# EAGLE design 297-298 (EAGLE 5.01)
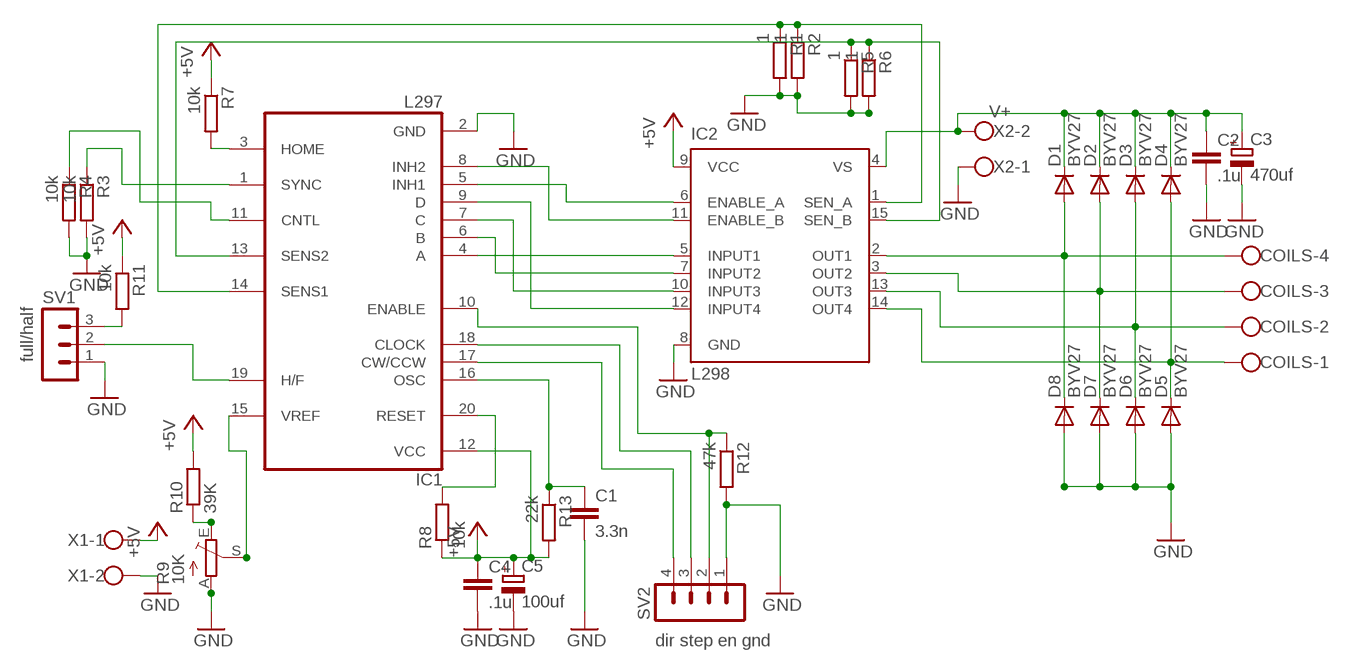
[diagram p0: schematic, sheet 1]

## Parts
C1  3.3n  C2.5/5  [C2.5-5]
C2  .1u  C2.5/5  [C2.5-5]
C3  470uf  CPOL-EUE3.5-8  [E3,5-8]
C4  .1u  C2.5/5  [C2.5-5]
C5  100uf  CPOL-EUE3.5-8  [E3,5-8]
COILS  W237-4  [W237-4]
D1  BYV27  [SOD57-10]
D2  BYV27  [SOD57-10]
D3  BYV27  [SOD57-10]
D4  BYV27  [SOD57-10]
D5  BYV27  [SOD57-10]
D6  BYV27  [SOD57-10]
D7  BYV27  [SOD57-10]
D8  BYV27  [SOD57-10]
IC1  L297  [DIL20]
IC2  L298  [MULTIWATT-15]
R1  1  R-EU_0207/15  [0207/15]
R2  1  R-EU_0207/15  [0207/15]
R3  10k  R-EU_0207/10  [0207/10]
R4  10k  R-EU_0207/10  [0207/10]
R5  1  R-EU_0207/15  [0207/15]
R6  1  R-EU_0207/15  [0207/15]
R7  10k  R-EU_0207/10  [0207/10]
R8  10k  R-EU_0207/10  [0207/10]
R9  10K  TRIM_EU-CA9V  [CA9V]
R10  39K  R-EU_0207/10  [0207/10]
R11  10k  R-EU_0207/10  [0207/10]
R12  47k  R-EU_0207/10  [0207/10]
R13  22k  R-EU_0207/10  [0207/10]
SV1  MA03-1  [MA03-1]
SV2  MA04-1  [MA04-1]
X1  W237-102  [W237-102]
X2  V+  W237-102  [W237-102]

## Nets
+5V: C4.1 C5.+ IC1.12(VCC) IC2.9(VCC) R7.1 R8.1 R10.2 R11.1 R13.2 X1.1
GND: C1.2 C2.2 C3.- C4.2 C5.- D5.A D6.A D7.A D8.A IC1.2(GND) IC2.8(GND) R1.2 R2.2 R3.2 R4.2 R5.2 R6.2 R9.A R12.2 SV1.1 SV2.1 X1.2 X2.1
N$1: IC1.4(A) IC2.5(INPUT1)
N$2: IC1.6(B) IC2.7(INPUT2)
N$3: IC1.7(C) IC2.10(INPUT3)
N$4: IC1.9(D) IC2.12(INPUT4)
N$5: IC1.8(INH2) IC2.11(ENABLE_B)
N$6: IC1.5(INH1) IC2.6(ENABLE_A)
N$7: IC1.15(VREF) R9.S
N$8: R9.E R10.1
N$9: COILS.4 D1.A D8.C IC2.2(OUT1)
N$10: COILS.3 D2.A D7.C IC2.3(OUT2)
N$11: COILS.2 D3.A D6.C IC2.13(OUT3)
N$12: COILS.1 D4.A D5.C IC2.14(OUT4)
N$13: IC1.13(SENS2) IC2.15(SEN_B) R5.1 R6.1
N$14: IC1.14(SENS1) IC2.1(SEN_A) R1.1 R2.1
N$15: IC1.1(SYNC) R3.1
N$16: IC1.19(H/F) SV1.2
N$17: R11.2 SV1.3
N$18: IC1.10(ENABLE) R12.1 SV2.2
N$19: IC1.18(CLOCK) SV2.3
N$20: IC1.17(CW/CCW) SV2.4
N$21: C1.1 IC1.16(OSC) R13.1
N$22: IC1.11(CNTL) R4.1
N$23: IC1.3(HOME) R7.2
N$24: C2.1 C3.+ D1.C D2.C D3.C D4.C IC2.4(VS) X2.2
N$25: IC1.20(RESET) R8.2

## Notes on the sheet
- full/half
- dir step en gnd

## Library data of the parts
C1 C2 C4 = capacitor-wima:C: CAPACITOR naming: grid - package width
C3 C5 = rcl:CPOL-EU: POLARIZED CAPACITOR, European symbol
COILS = con-wago-500:W237-4: WAGO SCREW CLAMP
D1-D8 = diode:BYV27: DIODE ultra fast
IC1 = st-microelectronics:L297: STEPPER MOTOR CONTROLLER
IC2 = st-microelectronics:L298: DUAL FULL-BRIDGE DRIVER
R1 R2 R5 R6 = resistor:R-EU_: RESISTOR, European symbol
R3 R4 R7 R8 R10-R13 = rcl:R-EU_: RESISTOR, European symbol
R9 = pot:TRIM_EU-: POTENTIOMETER
SV1 = con-lstb:MA03-1: PIN HEADER
SV2 = con-lstb:MA04-1: PIN HEADER
X1 X2 = con-wago-500:W237-102: WAGO SCREW CLAMP

## Board
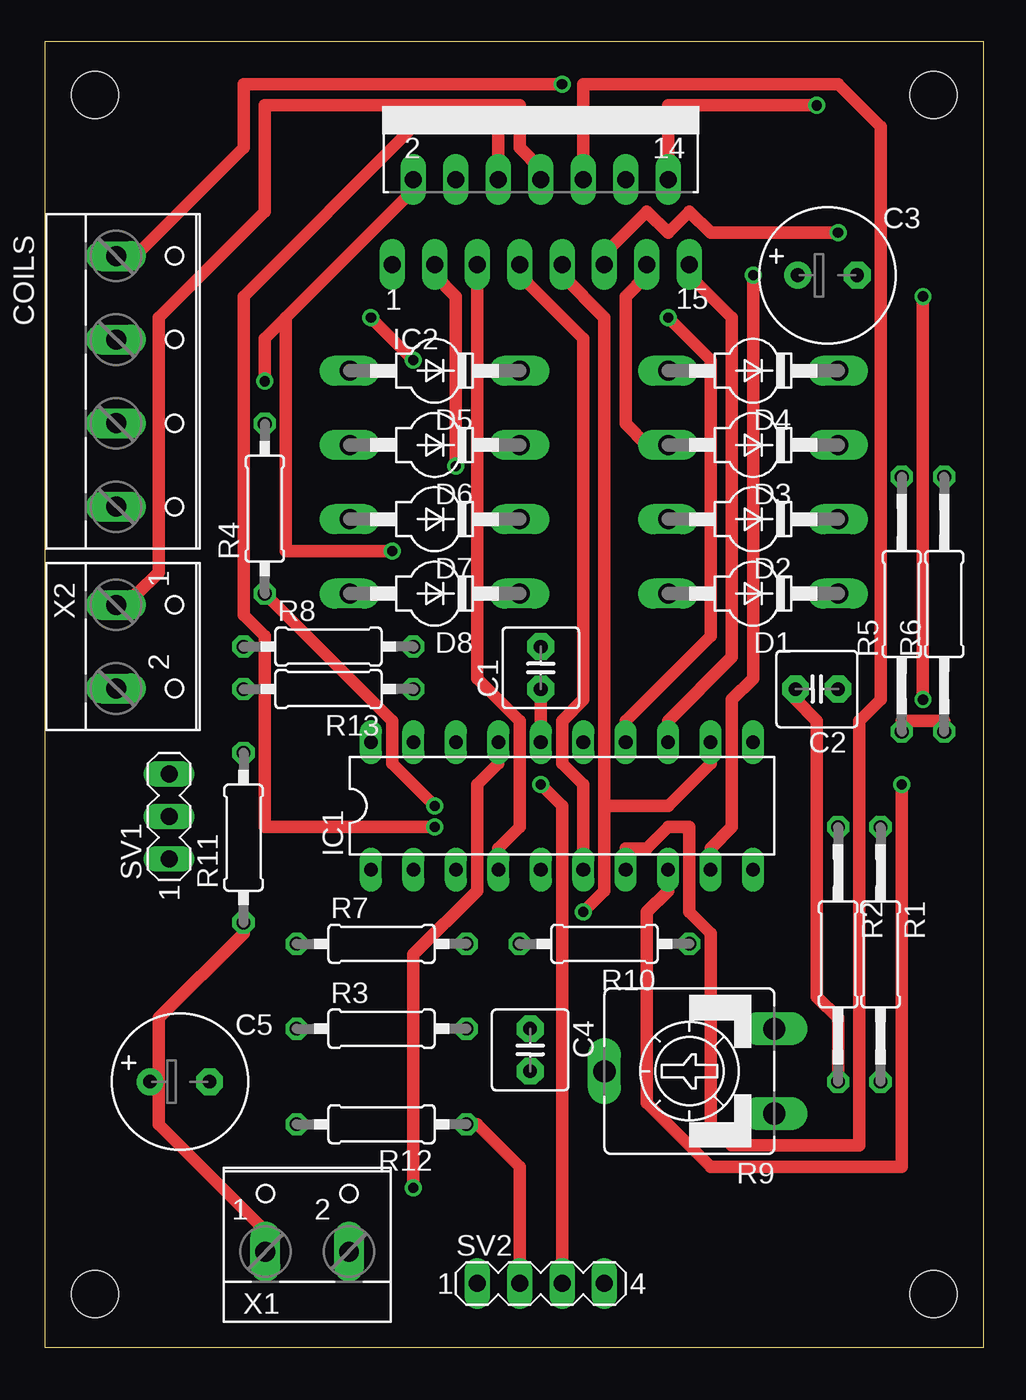
[diagram p1: board, top side]
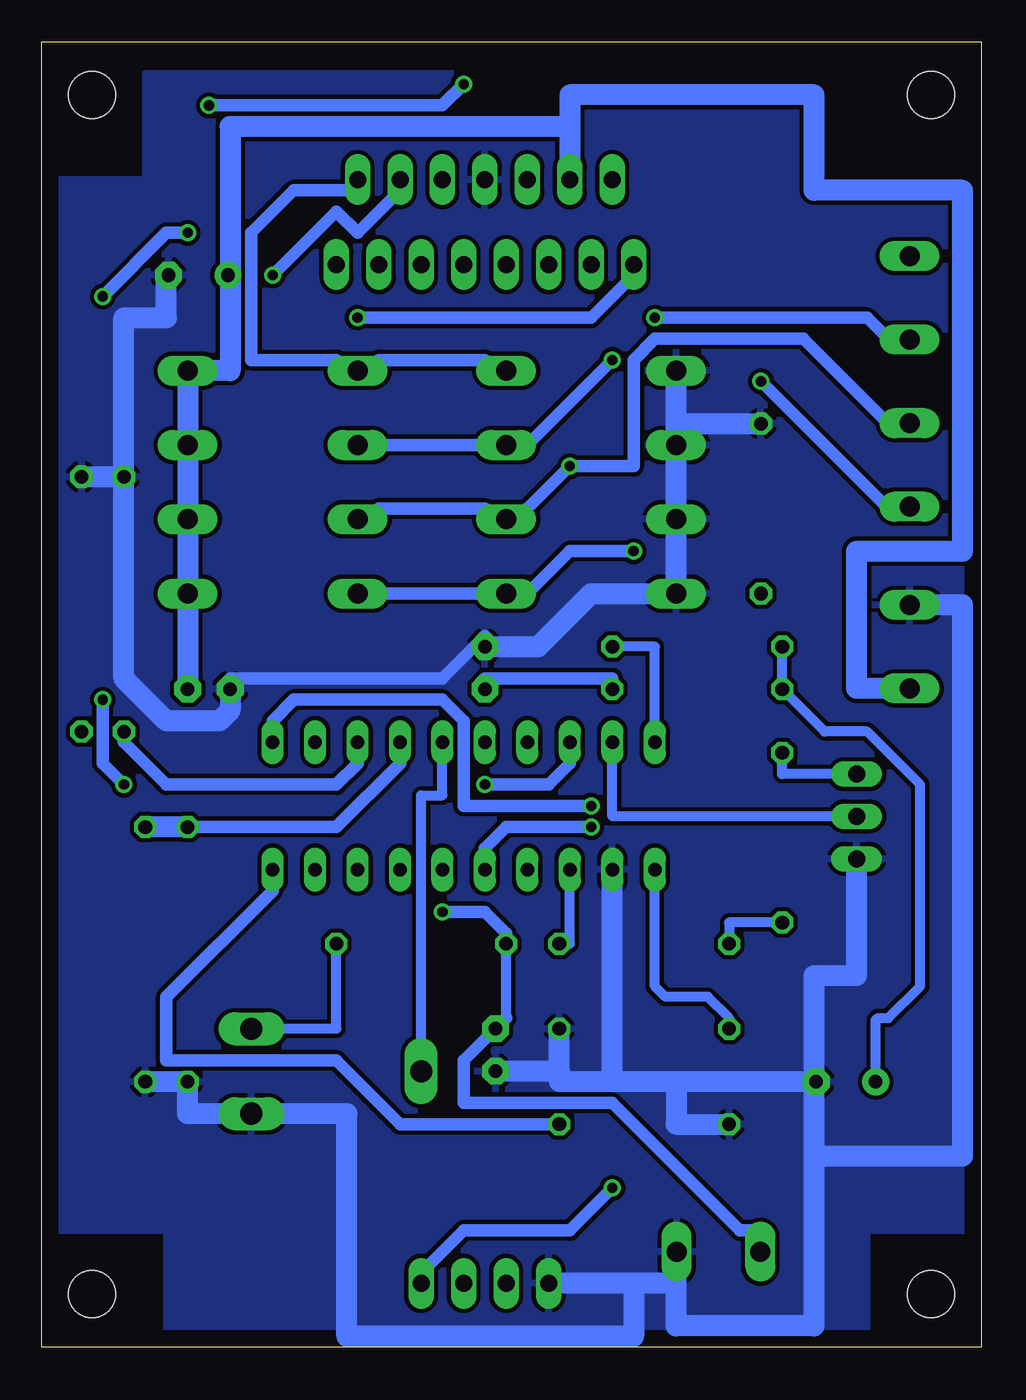
[diagram p2: board, bottom side, seen from below]

Size 56.19 x 78.09 mm. Coordinates in mm from the lower left corner, seen from the top.
Outline: 0,0 56.19,0 56.19,78.09 0,78.09 0,0
Copper layers (1*16): Top 0.035mm / dielectric 1.5mm / Bottom 0.035mm
Design rules "default *": minimum track width 30mil, minimum drill 24mil, track to track 8mil, track to pad 8mil, pad to pad 8mil, via to via 8mil, smd to smd 8mil, copper to edge 40mil, drill to drill 8mil, minimum pad ring 10mil, minimum via ring 8mil, stop-mask expansion 4mil, vias tented up to drill 0mil, thermal gap 10mil
Holes 2.8 mm at 3.01,74.92 53.17,74.92 53.17,3.17 3.01,3.17

### Footprints (pad centres in the part's own frame; a part is rotated, then mirrored left to right if it is on the bottom)
C2.5-5 = drill 0.813 pad 1.6 octagon: 1 -1.27,0; 2 1.27,0
E3,5-8 = drill 0.813 pad 1.6: + -1.778,0 | drill 0.813 pad 1.6 octagon: - 1.778,0
W237-4 = drill 1.194 long: 1 -7.5,-1.27; 2 -2.5,-1.27; 3 2.5,-1.27; 4 7.5,-1.27
SOD57-10 = drill 1.194 long: A 5.08,0; C -5.08,0
DIL20 = drill 0.813 long: 1 -11.43,-3.81; 2 -8.89,-3.81; 3 -6.35,-3.81; 4 -3.81,-3.81; 5 -1.27,-3.81; 6 1.27,-3.81; 7 3.81,-3.81; 8 6.35,-3.81; 9 8.89,-3.81; 10 11.43,-3.81; 11 11.43,3.81; 12 8.89,3.81; 13 6.35,3.81; 14 3.81,3.81; 15 1.27,3.81; 16 -1.27,3.81; 17 -3.81,3.81; 18 -6.35,3.81; 19 -8.89,3.81; 20 -11.43,3.81
MULTIWATT-15 = drill 1.016 long: 1 -8.89,-7.62; 2 -7.62,-2.54; 3 -6.35,-7.62; 4 -5.08,-2.54; 5 -3.81,-7.62; 6 -2.54,-2.54; 7 -1.27,-7.62; 8 0,-2.54; 9 1.27,-7.62; 10 2.54,-2.54; 11 3.81,-7.62; 12 5.08,-2.54; 13 6.35,-7.62; 14 7.62,-2.54; 15 8.89,-7.62
0207/15 = drill 0.813 octagon: 1 -7.62,0; 2 7.62,0
0207/10 = drill 0.813 octagon: 1 -5.08,0; 2 5.08,0
CA9V = drill 1.321 long: A -2.54,-5.08; E 2.54,-5.08; S 0,5.08
MA03-1 = drill 1.016 long: 1 -2.54,0; 2 0,0; 3 2.54,0
MA04-1 = drill 1.016 long: 1 -3.81,0; 2 -1.27,0; 3 1.27,0; 4 3.81,0
W237-102 = drill 1.194 long: 1 -2.5,-1.27; 2 2.5,-1.27

### Placement (x,y rotation side)
C1  29.68,40.64 90 top
C2  46.19,39.37 180 top
C3  46.82,64.13 0 top
C4  29.04,17.77 270 top
C5  8.09,15.87 0 top
COILS  5.55,57.78 270 top
D1  42.38,45.08 180 top
D2  42.38,49.53 180 top
D3  42.38,53.97 180 top
D4  42.38,58.41 180 top
D5  23.33,58.41 180 top
D6  23.33,53.97 180 top
D7  23.33,49.53 180 top
D8  23.33,45.08 180 top
IC1  30.95,32.38 0 top
IC2  29.68,72.38 0 top
R1  50,23.49 270 top
R2  47.46,23.49 270 top
R3  20.15,19.04 0 top
R4  13.17,50.16 90 top
R5  51.27,44.45 90 top
R6  53.81,44.45 90 top
R7  20.15,24.12 0 top
R8  16.98,41.91 0 top
R9  38.57,16.5 90 top
R10  33.49,24.12 180 top
R11  11.9,30.47 90 top
R12  20.15,13.33 180 top
R13  16.98,39.37 180 top
SV1  7.46,31.74 90 top
SV2  29.68,3.8 0 top
X1  15.71,6.98 0 top
X2  5.55,41.91 270 top

### Tracks (layer width: path | path; a pad name or v marks a point on that pad's centre or on a via)
+5V  (via drill 0.61)
  Top 0.762: 6.82,15.87 6.82,13.33 13.17,6.98 X1.1 | 6.82,15.87 6.82,19.68 11.9,24.76 R11.1 | 6.82,15.87 C5.+ | 33.49,32.38 37.3,32.38 39.84,34.92 IC1.12 | 33.49,32.38 33.49,61.59 30.95,64.13 IC2.9 | v32.22,26.03 33.49,27.3 33.49,32.38
  Bottom 0.61: R11.1 15.08,25.39 R7.1 | R8.1 R13.2 9.36,36.83 6.82,36.83 3.64,33.65 3.64,21.58 5.55,19.68 6.18,19.68 6.31,19.55 C5.+ | R10.2 28.41,19.68 C4.1
  Bottom 0.762: 28.41,19.68 30.95,17.14 30.95,14.6 22.06,14.6 14.44,6.98 13.17,6.98 X1.1 | v32.22,26.03 29.68,26.03 28.41,24.76 R10.2
GND
  Top 0.762: IC2.8 29.68,70.48 28.41,71.75 28.41,74.29 13.17,74.29 13.17,67.94 6.82,61.59 6.82,46.35 5.55,45.08 X2.1 | R2.2 47.46,19.68 46.19,20.95 46.19,37.46 44.92,38.73 C2.2
  Bottom 0.762: C1.2 29.68,42.54 32.22,40 44.92,40 C2.2
  Bottom 1.27: X2.1 1.1,44.41 1.1,11.43 10,11.43 | 10,11.43 10,15.87 | X1.2 18.25,5.71 18.25,3.8 | 18.25,3.8 18.25,1.27 10,1.27 10,11.43 | 18.25,3.8 20.79,3.8 | 20.79,3.8 SV2.1 | 20.79,3.8 20.79,0.63 37.94,0.63 37.94,13.97 R9.A 47.46,13.97 R2.2 R1.2 | 18.25,55.24 D6.A D7.A D8.A 23.33,45.08 26.5,41.91 C1.2 | 18.25,55.24 D5.A | 18.25,55.24 R4.2 | 10,15.87 18.25,15.87 | 18.25,15.87 22.06,15.87 | 22.06,15.87 25.23,15.87 25.23,16.5 | 25.23,16.5 R3.2 | 22.06,15.87 IC1.2 | SV1.1 7.46,22.22 10,22.22 10,15.87 | 10,15.87 C5.- | R12.2 18.25,13.33 18.25,15.87 | 25.23,16.5 C4.2 | C3.- 48.73,64.13 48.73,61.59 51.27,61.59 R5.2 | R5.2 R6.2 | R5.2 51.27,40 48.73,37.46 45.55,37.46 44.92,38.1 C2.2
  pour Bottom (isolate 0.254): 0.47,70.48 8.73,70.48 8.73,76.19 50,76.19 50,69.84 55.71,69.84 55.71,6.98 48.73,6.98 48.73,0.63 6.82,0.63 6.82,6.98 0.47,6.98
N$1
  Top 0.762: IC1.4 27.14,29.84 28.41,31.11 28.41,37.46 25.87,40 IC2.5
N$2
  Top 0.762: IC1.6 32.22,33.65 30.95,34.92 30.95,37.46 32.22,38.73 32.22,60.32 28.41,64.13 IC2.7
N$3
  Top 0.762: IC1.7 34.76,29.84 36.03,29.84 37.3,31.11 38.57,31.11 38.57,26.03 39.84,24.76 39.84,13.33 41.11,12.06 48.73,12.06 48.73,37.46 50,38.73 50,73.02 47.46,75.56 32.22,75.56 IC2.10
N$4  (via drill 0.61)
  Top 0.762: v42.38,64.13 42.38,40 41.11,38.73 41.11,31.11 39.84,29.84 IC1.9
  Bottom 0.762: v42.38,64.13 38.57,67.94 37.3,66.67 34.76,69.21 IC2.12
N$5  (via drill 0.61)
  Top 0.762: v51.27,33.65 51.27,10.79 39.84,10.79 36.03,14.6 36.03,26.03 37.3,27.3 IC1.8 | v52.54,38.73 v52.54,62.86 | v47.46,66.67 39.84,66.67 38.57,67.94 37.3,66.67 36.03,67.94 33.49,65.4 IC2.11
  Bottom 0.762: v51.27,33.65 52.54,34.92 v52.54,38.73 | v52.54,62.86 48.73,66.67 v47.46,66.67
N$6  (via drill 0.61)
  Top 0.762: v23.33,31.11 13.17,31.11 13.17,42.54 11.9,43.81 11.9,62.86 22.06,73.02 27.14,73.02 IC2.6
  Bottom 0.762: v23.33,31.11 28.41,31.11 29.68,29.84 IC1.5
N$7
  Bottom 0.61: R9.S 33.49,33.02 32.22,33.02 IC1.15
N$8
  Bottom 0.61: R9.E 38.57,19.04 R10.1
N$9  (via drill 0.61)
  Top 0.762: 14.44,61.59 13.17,60.32 v13.17,57.78 | 14.44,61.59 22.06,69.21 IC2.2 | v20.79,47.62 14.44,47.62 14.44,61.59
  Bottom 0.762: D1.A D8.C 27.14,45.08 24.6,47.62 v20.79,47.62 | v13.17,57.78 5.55,50.16 COILS.4
N$10  (via drill 0.61)
  Top 0.762: v24.6,52.7 24.6,62.86 23.33,64.13 IC2.3
  Bottom 0.762: D2.A 36.03,50.16 29.68,50.16 D7.C 27.14,50.16 v24.6,52.7 20.79,52.7 20.79,59.05 19.52,60.32 10.63,60.32 5.55,55.24 COILS.3
N$11  (via drill 0.61)
  Top 0.762: IC2.13 36.03,64.13 34.76,62.86 34.76,55.24 36.03,53.97 D3.A | v19.52,61.59 v22.06,59.05
  Bottom 0.762: v19.52,61.59 6.82,61.59 5.55,60.32 COILS.2 | v22.06,59.05 27.14,53.97 D6.C D3.A
N$12  (via drill 0.61)
  Top 0.762: v30.95,75.56 11.9,75.56 11.9,71.75 5.55,65.4 COILS.1 | v46.19,74.29 37.3,74.29 IC2.14
  Bottom 0.762: IC2.14 37.3,69.21 41.11,69.21 43.65,66.67 43.65,59.05 38.57,59.05 D4.A 36.03,59.05 29.68,59.05 D5.C | v30.95,75.56 32.22,74.29 v46.19,74.29
N$13
  Top 0.762: R6.1 53.81,37.46 51.27,37.46 R5.1 | IC2.15 38.57,64.13 41.11,61.59 41.11,41.27 37.3,37.46 IC1.13
  Bottom 0.762: IC1.13 37.3,34.92 38.57,33.65 48.73,33.65 51.27,36.19 R5.1
N$14  (via drill 0.61)
  Top 0.762: v37.3,61.59 39.84,59.05 39.84,42.54 34.76,37.46 IC1.14
  Bottom 0.762: R2.1 38.57,31.11 34.76,34.92 IC1.14 | v37.3,61.59 23.33,61.59 20.79,64.13 IC2.1
  Bottom 1.27: R2.1 R1.1
N$15
  Bottom 0.61: R3.1 15.08,19.68 16.34,20.95 18.88,20.95 19.52,21.58 IC1.1
N$16
  Bottom 0.61: SV1.2 22.06,31.74 IC1.19
N$17
  Bottom 0.61: SV1.3 11.9,34.29 R11.2
N$18
  Top 0.762: R12.1 25.87,13.33 28.41,10.79 SV2.2
  Bottom 0.762: IC1.10 42.38,27.3 48.73,20.95 48.73,17.14 38.57,17.14 34.76,13.33 R12.1
N$19  (via drill 0.61)
  Top 0.762: v29.68,33.65 30.95,32.38 SV2.3
  Bottom 0.762: v29.68,33.65 25.87,33.65 24.6,34.92 IC1.18
N$20  (via drill 0.61)
  Top 0.762: v22.06,9.52 22.06,23.49 25.87,27.3 25.87,33.65 27.14,34.92 IC1.17
  Bottom 0.762: v22.06,9.52 24.6,6.98 30.95,6.98 33.49,4.44 SV2.4
N$21
  Top 0.762: C1.1 IC1.16
  Bottom 0.762: R13.1 22.06,40 29.68,40 C1.1
N$22  (via drill 0.61)
  Top 0.762: R4.1 20.79,37.46 20.79,34.92 v23.33,32.38
  Bottom 0.762: v23.33,32.38 30.95,32.38 30.95,37.46 32.22,38.73 41.11,38.73 42.38,37.46 IC1.11
N$23
  Bottom 0.61: IC1.3 24.6,24.12 R7.2
N$24
  Bottom 1.27: C2.1 D1.C D2.C D3.C D4.C 44.92,58.41 44.92,64.13 | 44.92,64.13 C3.+ | 44.92,64.13 44.92,73.02 24.6,73.02 | 24.6,73.02 IC2.4 | X2.2 7.46,39.41 7.46,47.62 1.1,47.62 1.1,69.21 10,69.21 10,74.92 24.6,74.92 24.6,73.02
N$25
  Bottom 0.61: IC1.20 19.52,41.91 R8.2